# EAGLE design M_L_ext_5w_switch (EAGLE 9.6.2)
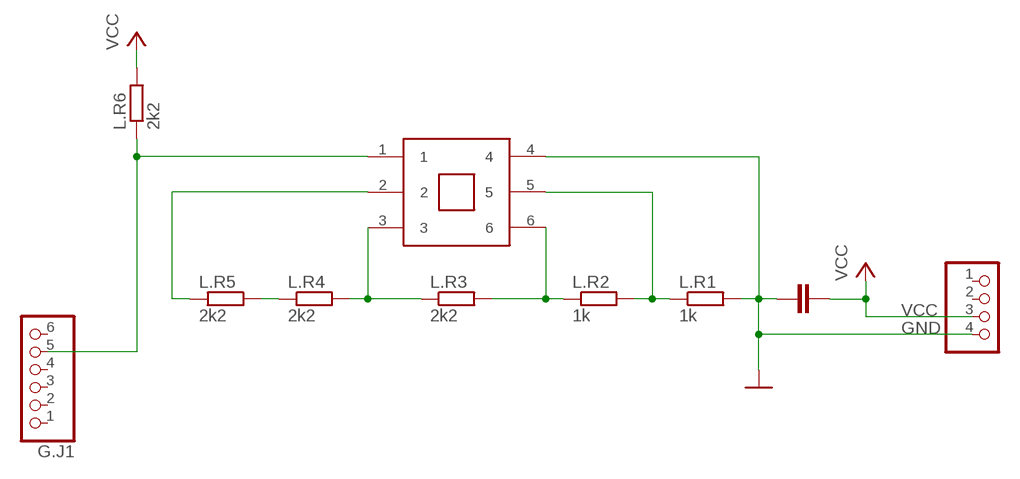
[diagram p0: schematic, sheet 1]

## Parts
G.J1  PINHD-1X6  [1X06]
G.J2  PINHD-1X4  [1X04]
L.C1  100n  C-EUC0603  [C0603]
L.R1  1k  R-EU_R0603  [R0603]
L.R2  1k  R-EU_R0603  [R0603]
L.R3  2k2  R-EU_R0603  [R0603]
L.R4  2k2  R-EU_R0603  [R0603]
L.R5  2k2  R-EU_R0603  [R0603]
L.R6  2k2  R-EU_R0603  [R0603]
L.SW1  5_WAY_SWITCH  [5_WAY_SWITCH]

## Nets
GND: G.J2.4 L.C1.1 L.R1.2 L.SW1.4
N$1: L.R4.1 L.R5.1
N$4: L.R1.1 L.R2.2 L.SW1.5
N$5: L.R2.1 L.R3.2 L.SW1.6
N$6: L.R3.1 L.R4.2 L.SW1.3
N$7: G.J1.5 L.R6.1 L.SW1.1
N$8: L.R5.2 L.SW1.2
VCC: G.J2.3 L.C1.2 L.R6.2
Unconnected: G.J1.1 G.J1.2 G.J1.3 G.J1.4 G.J1.6 G.J2.1 G.J2.2

## Library data of the parts
G.J1 = pinhead2:PINHD-1X6: PIN HEADER
G.J2 = pinhead2:PINHD-1X4: PIN HEADER
L.C1 = rcl:C-EU: CAPACITOR, European symbol; SPICEPREFIX: C
L.R1-L.R6 = rcl:R-EU_: RESISTOR, European symbol; SPICEPREFIX: R
L.SW1 = hugo:5_WAY_SWITCH

## Board
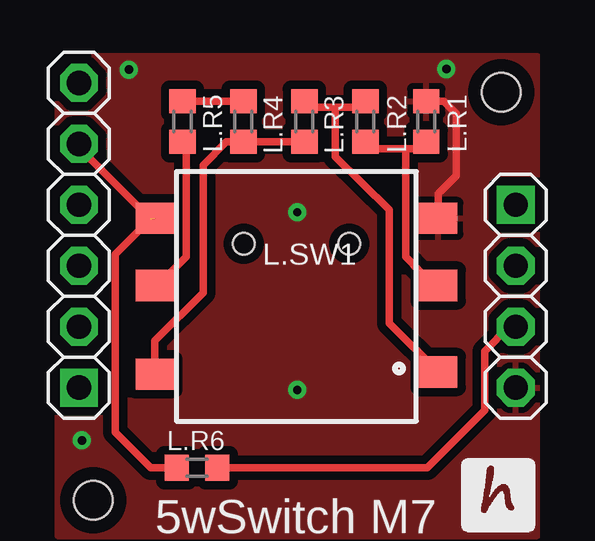
[diagram p1: board, top side]
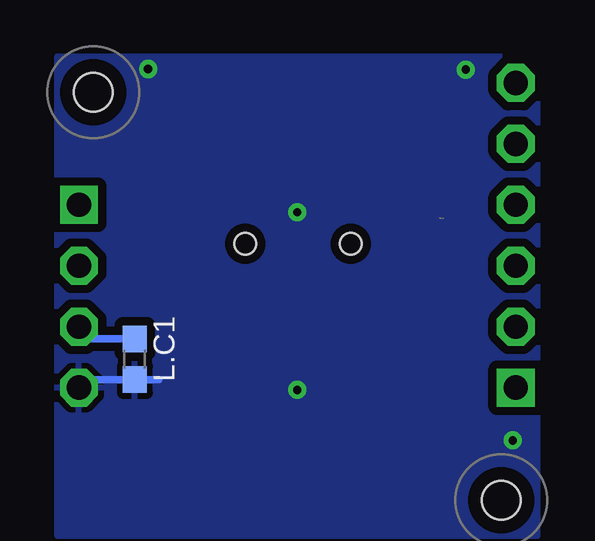
[diagram p2: board, bottom side, seen from below]

No outline drawn. Coordinates in mm, seen from the top.
Copper layers (1*16): Top 0.035mm / dielectric 1.5mm / Bottom 0.035mm
Design rules "default *": minimum track width 12mil, minimum drill 0.35mm, track to track 14mil, track to pad 13mil, pad to pad 10mil, via to via 14mil, smd to smd 14mil, copper to edge 15mil, drill to drill 15mil, minimum pad ring 10mil, minimum via ring 8mil, stop-mask expansion 4mil, vias tented up to drill 0mil, thermal gap 10mil
Holes 1.6 mm at 2,2 19,19
tRestrict: area 18,18 to 20,20; area 1,1 to 3,3
bRestrict: area 1,1 to 3,3; area 18,18 to 20,20

### Footprints (pad centres in the part's own frame; a part is rotated, then mirrored left to right if it is on the bottom)
1X06 = drill 1.016 pad 1.575 square: 1 -6.35,0 | drill 1.016 pad 1.575 octagon: 2 -3.81,0; 3 -1.27,0; 4 1.27,0; 5 3.81,0; 6 6.35,0
1X04 = drill 1.016 pad 1.575 square: 1 -3.81,0 | drill 1.016 pad 1.575 octagon: 2 -1.27,0; 3 1.27,0; 4 3.81,0
C0603 = smd 1.1 x 1: 1 -0.85,0; 2 0.85,0
R0603 = smd 1 x 1.1: 1 -0.85,0; 2 0.85,0
5_WAY_SWITCH = smd 1.6 x 1.3: 1 -6,3; 2 -6,0.2; 3 -6,-3.5; 4 5.8,3; 5 5.8,0.2; 6 5.8,-3.4 | hole 0.9: 2.1,1.95; -2.3,1.95

### Placement (x,y rotation side)
G.J1  1.4,13.04 90 top
G.J2  19.6,10.5 270 top
L.C1  17.27,7.87 90 bottom
L.R1  15.88,17.78 90 top
L.R2  13.34,17.78 270 top
L.R3  10.79,17.78 90 top
L.R4  8.26,17.78 270 top
L.R5  5.71,17.78 270 top
L.R6  6.32,3.35 0 top
L.SW1  10.57,10.74 0 top

### Tracks (layer width: path | path; a pad name or v marks a point on that pad's centre or on a via)
GND  (via drill 0.35)
  Top 0.305: L.SW1.4 16.37,14.77 17.12,15.52 17.12,18.11 16.6,18.63 L.R1.2
  Bottom 0.305: G.J2.4 19.27,7.02 L.C1.1 16.27,7.02
  other vias: 10.5,14 10.5,6.6 3.48,19.94 16.71,19.96 1.52,4.5
  pour Top (isolate 0.254): 0.5,20.5 0.5,0.5 20.5,0.5 20.5,20.5
  pour Bottom (isolate 0.254): 0.5,20.5 0.5,0.5 20.5,0.5 20.5,20.5
N$1
  Top 0.305: L.R4.1 8.26,18.64 8.23,18.68 8.22,18.63 L.R5.1
N$4
  Top 0.305: L.R1.1 15.6,16.65 15.01,16.65 | L.R2.2 13.48,16.65 15.01,16.65 | 15.01,16.65 15.01,12.14 16.19,10.94 L.SW1.5
N$5
  Top 0.305: L.R2.1 13.21,18.38 12.09,18.38 | 12.09,18.38 10.92,18.38 L.R3.2 | 12.09,18.38 12.09,16.32 14.33,14.11 14.33,9.38 L.SW1.6
N$6
  Top 0.305: L.SW1.3 4.57,8.64 6.58,10.65 6.58,15.96 7.54,16.93 L.R4.2 L.R3.1
N$7  (1 unrouted)
  Top 0.305: L.SW1.1 4.35,13.74 1.4,16.7 G.J1.5 | L.R6.1 4.39,3.35 2.92,4.83 2.92,12.24 4.4,13.72
N$8
  Top 0.305: L.SW1.2 4.67,10.94 5.87,12.14 5.87,16.57 L.R5.2
VCC
  Top 0.305: L.R6.2 15.9,3.35 18.3,5.75 18.3,8.21 19.32,9.23 G.J2.3
  Bottom 0.305: G.J2.3 19.09,8.72 L.C1.2

### Text on the board
tPlace: 5wSwitch M7